# Altium schematic sheet Filter Capacitors - FOTA Digital ICSP.SchDoc: FOTA Digital ICSP Filter Capacitors
size A4; DocumentNumber: 38; SheetNumber: 38; SheetTotal: 54
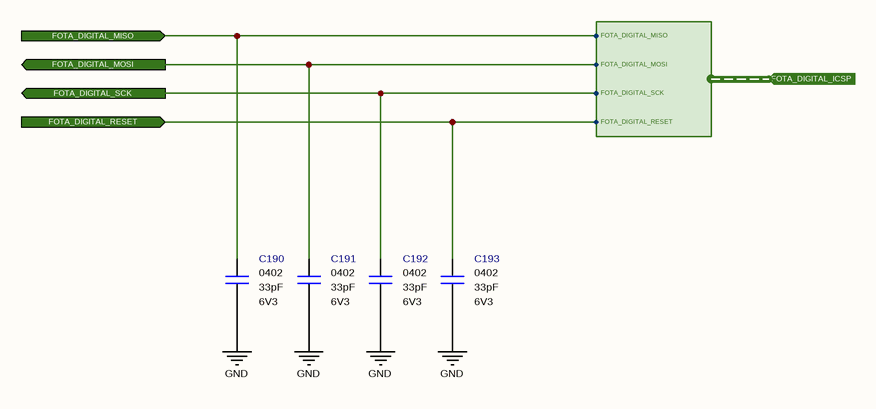
[diagram p0: Filter Capacitors - FOTA Digital ICSP.SchDoc]

## Parts
C190  value 33pF  Case: 0402  Voltage: 6V3  [CAPACITOR_0402]  (hidden comment: Multilayer Ceramic Capacitor)
C191  value 33pF  Case: 0402  Voltage: 6V3  [CAPACITOR_0402]  (hidden comment: Multilayer Ceramic Capacitor)
C192  value 33pF  Case: 0402  Voltage: 6V3  [CAPACITOR_0402]  (hidden comment: Multilayer Ceramic Capacitor)
C193  value 33pF  Case: 0402  Voltage: 6V3  [CAPACITOR_0402]  (hidden comment: Multilayer Ceramic Capacitor)

## Ports
FOTA_DIGITAL_ICSP (in, harness FOTA_DIGITAL_ICSP), FOTA_DIGITAL_MISO (in), FOTA_DIGITAL_MOSI (out), FOTA_DIGITAL_RESET (in), FOTA_DIGITAL_SCK (out)

## Harnesses
FOTA_DIGITAL_ICSP: FOTA_DIGITAL_SCK, FOTA_DIGITAL_MOSI, FOTA_DIGITAL_MISO, FOTA_DIGITAL_RESET

## Nets
GND: C190.1 C191.1 C192.1 C193.1
FOTA_DIGITAL_MISO: C190.2 ; port FOTA_DIGITAL_MISO, port FOTA_DIGITAL_ICSP.FOTA_DIGITAL_MISO
FOTA_DIGITAL_MOSI: C191.2 ; port FOTA_DIGITAL_MOSI, port FOTA_DIGITAL_ICSP.FOTA_DIGITAL_MOSI
FOTA_DIGITAL_RESET: C193.2 ; port FOTA_DIGITAL_RESET, port FOTA_DIGITAL_ICSP.FOTA_DIGITAL_RESET
FOTA_DIGITAL_SCK: C192.2 ; port FOTA_DIGITAL_SCK, port FOTA_DIGITAL_ICSP.FOTA_DIGITAL_SCK

## Notes on the sheet
- Title
- Size:
- Date:
- A4
- Number:
- Time:
- Revision:
- Sheet
- of
- File:

## Library data of the parts
C190-C193 = Capacitor - 33pF [0402-6V3]: Capacitor - 33pF [0402] (Ceramic); Manufacturer Name: Kemet; Manufacturer Part Number: C0402C330J9RACAUTO; Dielectric: X7R; Tolerance: 10%; Height: 0.5mm; Maximum Operating Temperature: +125; Minimum Operating Temperature: -55; ROHS: Yes; ComponentLink1Description: DataSheet; ComponentLink1URL: https://api.kemet.com/component-edge/download/datasheet/C0402C330J9RACAUTO.pdf; ComponentLink2Description: Mouser; ComponentLink2URL: https://www.mouser.com/Search/Refine.aspx?Keyword=80-C0402C330J9RAUTO; Supplier 1: Mouser; Supplier Part Number 1: 80-C0402C330J9RAUTO; Mouser Part Number: 80-C0402C330J9RAUTO